# Altium schematic sheet SFPGA_power.SchDoc: System FPGA power
size 420 x 297 mm; CheckedBy: T.Janicki; CompanyName: Creotech Instruments SA; DrawnBy: Greg Kasprowicz; Organization: CERN; Address1: European Organization for Nuclear Research; Address2: CH-1211 Geneve 23 - Switzerland; DocumentNumber: 10; Revision: -; SheetNumber: 16; SheetTotal: 19; EDA_Number: EDA-xxxx; Projet: Simple VME FMC Carrier; CreateDate: 20/11/2012; CheckedDate: 23/01/2012; DivGrp: BE-CO; Designer: G.Kasprowicz; DocumentName: SFPGA_power.SchDoc; ModifiedDate: -; Rule: PcbType=ProtelPcb
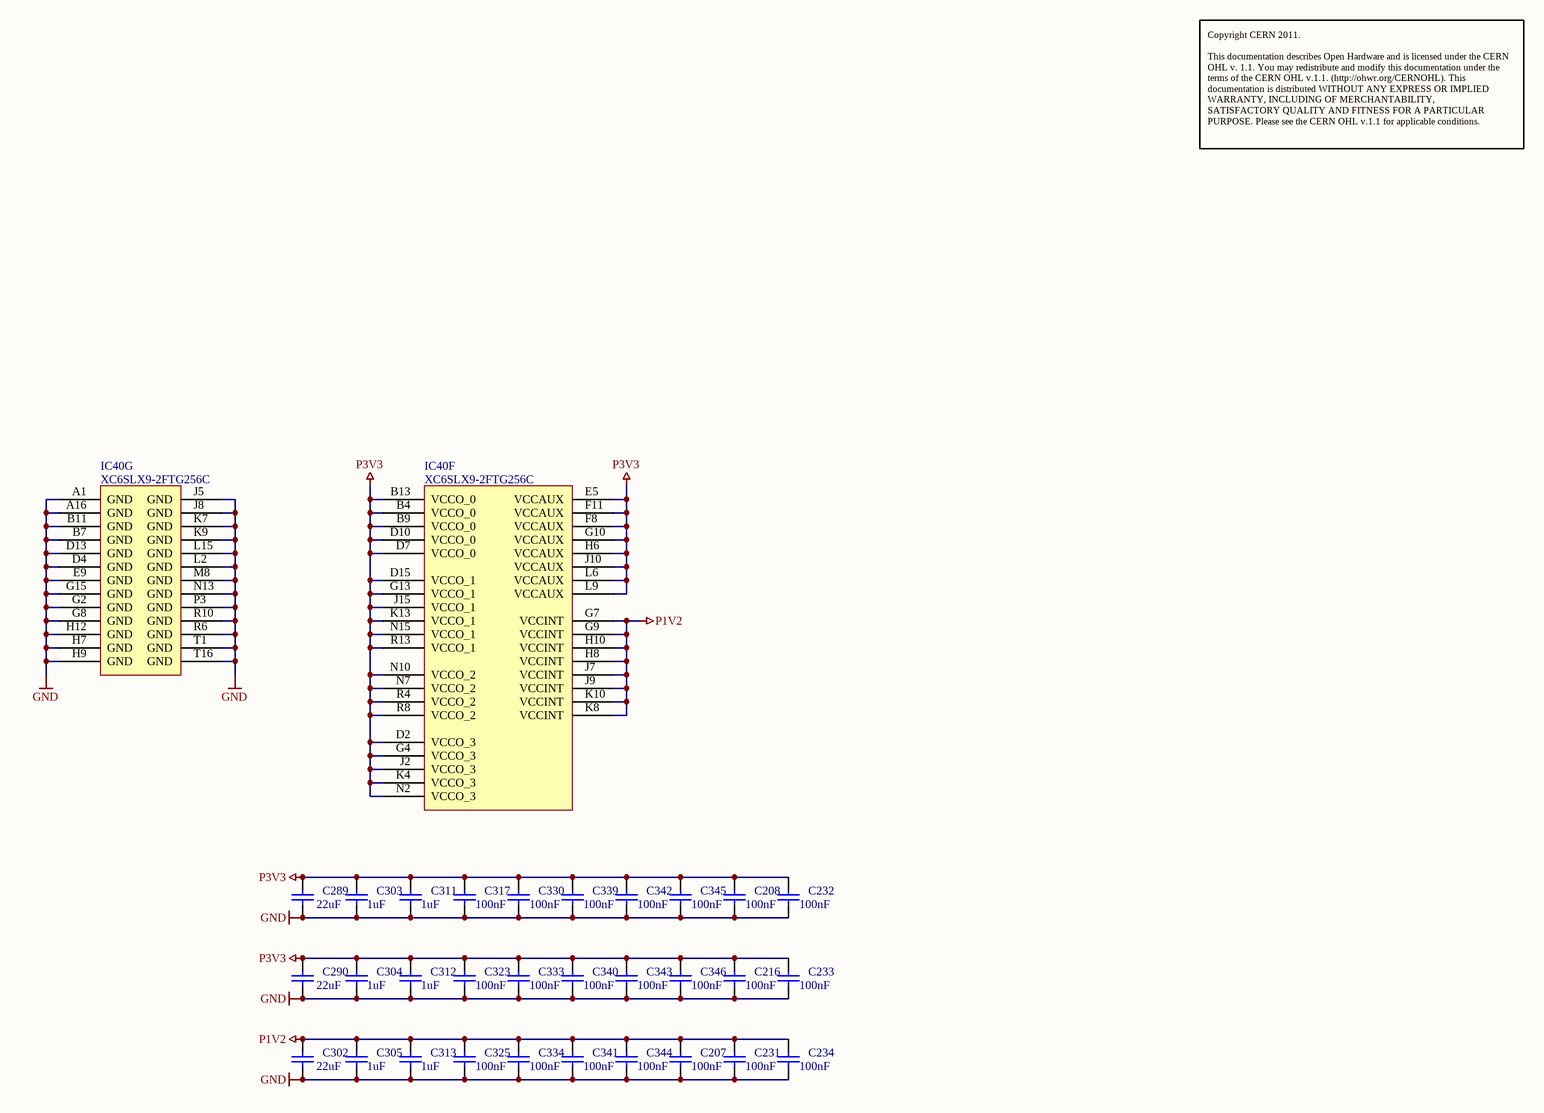
[diagram p0: SFPGA_power.SchDoc]

## Parts
C207  100nF  [CAPC1005X55N]
C208  100nF  [CAPC1005X55N]
C216  100nF  [CAPC1005X55N]
C231  100nF  [CAPC1005X55N]
C232  100nF  [CAPC1005X55N]
C233  100nF  [CAPC1005X55N]
C234  100nF  [CAPC1005X55N]
C289  22uF  [CAPC3216X180N]
C290  22uF  [CAPC3216X180N]
C302  22uF  [CAPC3216X180N]
C303  1uF  [CAPC1608X87N]
C304  1uF  [CAPC1608X87N]
C305  1uF  [CAPC1608X87N]
C311  1uF  [CAPC1608X87N]
C312  1uF  [CAPC1608X87N]
C313  1uF  [CAPC1608X87N]
C317  100nF  [CAPC1005X55N]
C323  100nF  [CAPC1005X55N]
C325  100nF  [CAPC1005X55N]
C330  100nF  [CAPC1005X55N]
C333  100nF  [CAPC1005X55N]
C334  100nF  [CAPC1005X55N]
C339  100nF  [CAPC1005X55N]
C340  100nF  [CAPC1005X55N]
C341  100nF  [CAPC1005X55N]
C342  100nF  [CAPC1005X55N]
C343  100nF  [CAPC1005X55N]
C344  100nF  [CAPC1005X55N]
C345  100nF  [CAPC1005X55N]
C346  100nF  [CAPC1005X55N]
IC40  XC6SLX9-2FTG256C  [BGA256C100P16X16_1700X1700X155]  (parts F,G of 7)

## Nets
GND: C207.1 C208.1 C216.1 C231.1 C232.1 C233.1 C234.1 C289.1 C290.1 C302.1 C303.1 C304.1 C305.1 C311.1 C312.1 C313.1 C317.1 C323.1 C325.1 C330.1 C333.1 C334.1 C339.1 C340.1 C341.1 C342.1 C343.1 C344.1 C345.1 C346.1 IC40.A1(GND) IC40.A16(GND) IC40.B7(GND) IC40.B11(GND) IC40.D4(GND) IC40.D13(GND) IC40.E9(GND) IC40.G2(GND) IC40.G8(GND) IC40.G15(GND) IC40.H7(GND) IC40.H9(GND) IC40.H12(GND) IC40.J5(GND) IC40.J8(GND) IC40.K7(GND) IC40.K9(GND) IC40.L2(GND) IC40.L15(GND) IC40.M8(GND) IC40.N13(GND) IC40.P3(GND) IC40.R6(GND) IC40.R10(GND) IC40.T1(GND) IC40.T16(GND)
P1V2: C207.2 C231.2 C234.2 C302.2 C305.2 C313.2 C325.2 C334.2 C341.2 C344.2 IC40.G7(VCCINT) IC40.G9(VCCINT) IC40.H8(VCCINT) IC40.H10(VCCINT) IC40.J7(VCCINT) IC40.J9(VCCINT) IC40.K8(VCCINT) IC40.K10(VCCINT)
P3V3: C208.2 C216.2 C232.2 C233.2 C289.2 C290.2 C303.2 C304.2 C311.2 C312.2 C317.2 C323.2 C330.2 C333.2 C339.2 C340.2 C342.2 C343.2 C345.2 C346.2 IC40.B4(VCCO_0) IC40.B9(VCCO_0) IC40.B13(VCCO_0) IC40.D2(VCCO_3) IC40.D7(VCCO_0) IC40.D10(VCCO_0) IC40.D15(VCCO_1) IC40.E5(VCCAUX) IC40.F8(VCCAUX) IC40.F11(VCCAUX) IC40.G4(VCCO_3) IC40.G10(VCCAUX) IC40.G13(VCCO_1) IC40.H6(VCCAUX) IC40.J2(VCCO_3) IC40.J10(VCCAUX) IC40.J15(VCCO_1) IC40.K4(VCCO_3) IC40.K13(VCCO_1) IC40.L6(VCCAUX) IC40.L9(VCCAUX) IC40.N2(VCCO_3) IC40.N7(VCCO_2) IC40.N10(VCCO_2) IC40.N15(VCCO_1) IC40.R4(VCCO_2) IC40.R8(VCCO_2) IC40.R13(VCCO_1)

## Notes on the sheet
- Copyright CERN 2011.
  This documentation describes Open Hardware and is licensed under the CERN OHL v. 1.1. You may redistribute and modify this documentation under the terms of the CERN OHL v.1.1. (http://ohwr.org/CERNOHL). This documentation is distributed WITHOUT ANY EXPRESS OR IMPLIED WARRANTY, INCLUDING OF MERCHANTABILITY, SATISFACTORY QUALITY AND FITNESS FOR A PARTICULAR PURPOSE. Please see the CERN OHL v.1.1 for applicable conditions.
- Project/Equipment
- Document
- Designer
- Drawn by
- Check.by
- File
- Last Mod.
- Print Date
- Sheet
- Size
- A3
- of
- Rev

## Library data of the parts
C207 C208 C216 C231-C234 C317 C323 C325 C330 C333 C334 C339-C346 = CC0402_100NF_16V_10%_X7R: Non-polarised capacitor; Part Description: SMD Multilayer Chip Ceramic Capacitor; Manufacturer: GENERIC; Manufacturer1 Part Number: 223878715649; Voltage: 16V; TC: X7R; Tolerance: ±10%; Table: Capacitors SMD; Part Number: CC0402_100NF_16V_10%_X7R; Component Kind: Standard; Component Type: Standard; Pin Count: 2; Value: 100nF; Status: Not Recommended; Manufacturer Part Number: CC0402_100NF_16V_10%_X7R; Case: 0402; Mounted: Yes; Socket: No; SMD: Yes; Manufacturer1 Example: PHYCOMP; Manufacturer1 ComponentHeight: 0.55mm; HelpURL: \\cern.ch\dfs\Applications\Altium\Datasheets\CC0402_X7R_PHYCOMP.pdf; Author: CERN DEM JLC; CreateDate: 03/12/2007; LatestRevisionDate: 03/12/2007
C289 C290 C302 = CC1206_22UF_10V_10%_X7R: Non-polarised capacitor; Part Description: SMD Multilayer Chip Ceramic Capacitor; Manufacturer: GENERIC; Manufacturer1 Part Number: GRM31CR71A226KE15L; Voltage: 10V; TC: X7R; Tolerance: ±10%; Table: Capacitors SMD; Part Number: CC1206_22UF_10V_10%_X7R; Component Kind: Standard; Component Type: Standard; Pin Count: 2; Value: 22uF; Status: Preferred; Manufacturer Part Number: CC1206_22UF_10V_10%_X7R; Case: 1206; Mounted: Yes; Socket: No; SMD: Yes; Manufacturer1 Example: MURATA; Manufacturer1 ComponentHeight: 1.8mm; HelpURL: \\cern.ch\dfs\Applications\Altium\Datasheets\CC1206_X7R_MURATA_GRM-HI-CAP.pdf; Author: CERN DEM JLC; CreateDate: 2010-06-08; LatestRevisionDate: 2010-06-08
C303-C305 C311-C313 = CC0603_1UF_16V_10%_X7R: Non-polarised capacitor; Part Description: SMD Multilayer Chip Ceramic Capacitor; Manufacturer: GENERIC; Manufacturer1 Part Number: 223824613663; Voltage: 16V; TC: X7R; Tolerance: ±10%; Table: Capacitors SMD; Part Number: CC0603_1UF_16V_10%_X7R; Component Kind: Standard; Component Type: Standard; Pin Count: 2; Value: 1uF; Status: Preferred; Manufacturer Part Number: CC0603_1uF_16V_10%_X7R; Case: 0603; Mounted: Yes; Socket: No; SMD: Yes; Manufacturer1 Example: PHYCOMP; Manufacturer1 ComponentHeight: 0.87mm; HelpURL: \\cern.ch\dfs\Applications\Altium\Datasheets\CC0805_X5R_PHYCOMP_HC.pdf; Author: CERN DEM JLC; CreateDate: 03/12/2007; LatestRevisionDate: 03/12/2007
IC40 = XC6SLX9-2FTG256C: Spartan-6 LX 1.2V FPGA, 186 User I/Os, 256-Ball Fine-Pitch Thin BGA (1.0mm Pitch), Speed Grade 2, Commercial Grade, Pb-Free; Manufacturer: XILINX; Table: Logic; Part Number: XC6SLX9-2FTG256C; Component Kind: Standard; Component Type: Standard; Device: XC6SLX9-2FTG256C; PackageDescription: BGA 1mm, Pitch, Square 256 Pin, 16 Columns x 16 Rows, Body 17mm X 17mm X 1.55mm H; Part Description: Spartan-6 LX 1.2V FPGA, 186 User I/Os, 256-Ball Fine-Pitch Thin BGA (1.0mm Pitch), Speed Grade 2, Commercial Grade, Pb-Free; Manufacturer Part Number: XC6SLX9-2FTG256C; Pin Count: 256; Case: BGA256; Mounted: Yes; Socket: No; SMD: Yes; ComponentHeight: 1.55mm; HelpURL: \\cern.ch\dfs\Applications\Altium\Datasheets\XC6SLX9-2FTG256C.pdf; ComponentLink1URL: \\cern.ch\dfs\Applications\Altium\Datasheets\XC6SLX9-2FTG256C_Package-Pinout.pdf; ComponentLink1Description: Package/Pinouts; Author: CERN DEM JLC; CreateDate: 2011-11-01; LatestRevisionDate: 2011-11-01